# Altium schematic sheet Top.SchDoc: RGBW LED Driver
size A4; DocumentNumber: 1; SheetNumber: 1; SheetTotal: 3
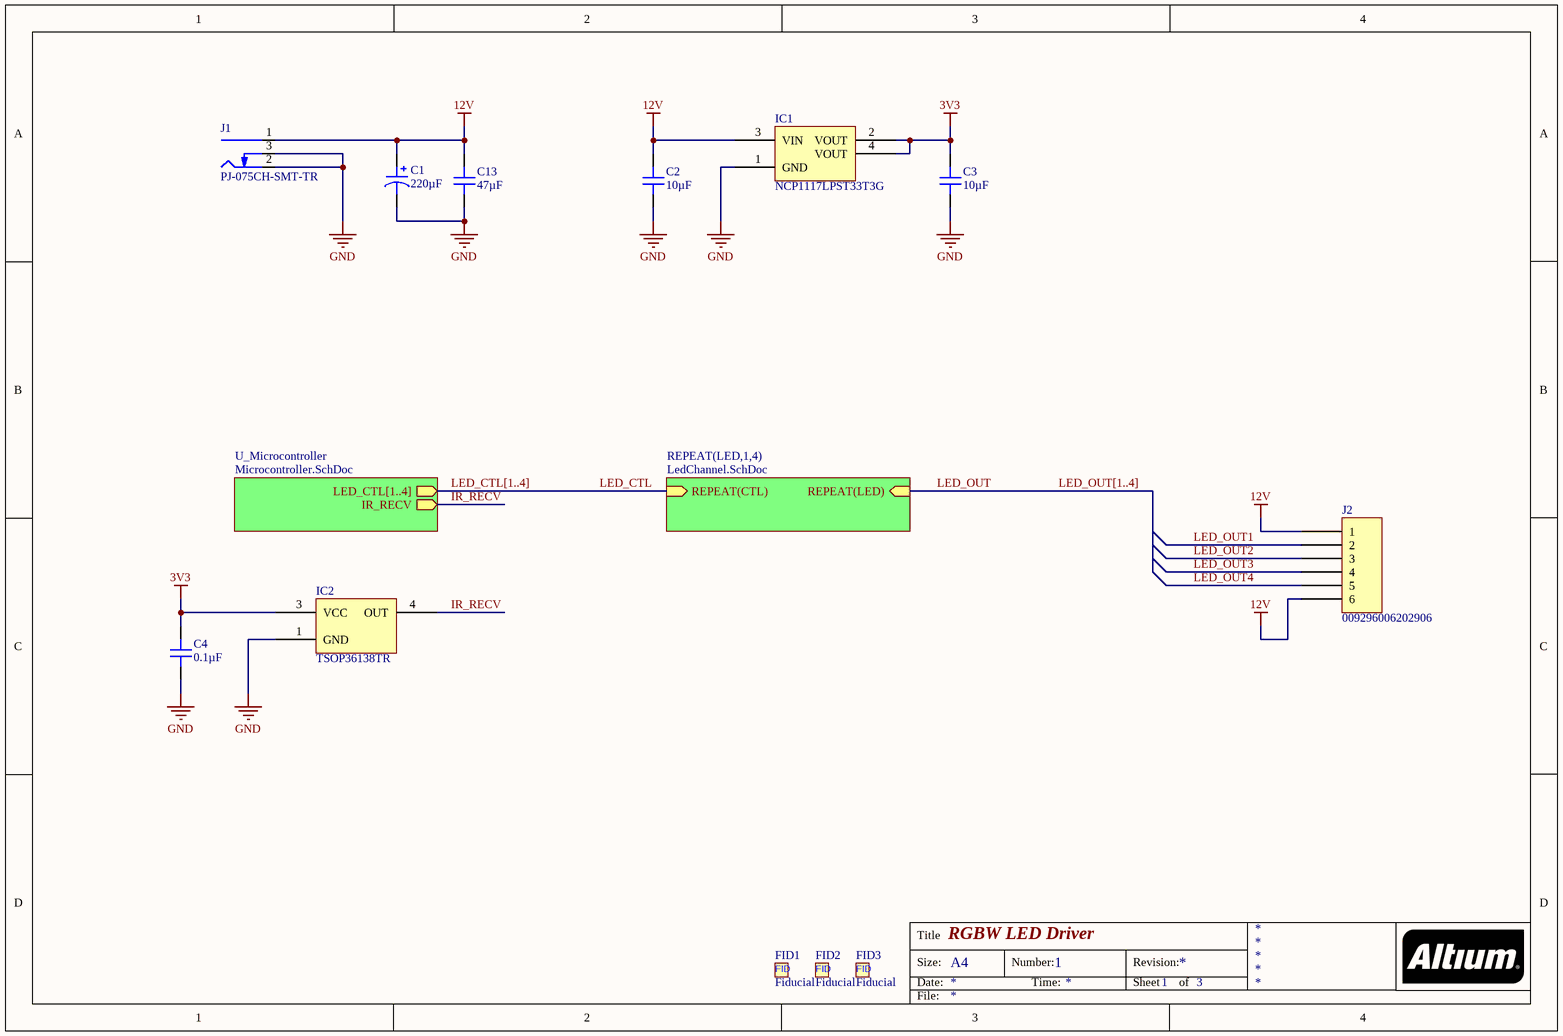
[diagram p0: Top.SchDoc]

## Parts
C1  220µF  [CAP ALSMD 8.3MM H10.5MM]
C2  10µF  [CAP 1206_3216 - 1.8MM]
C3  10µF  [CAP 1206_3216 - 1.8MM]
C4  0.1µF  [CAP 0603_1608]
C13  47µF  [CAP 1206_3216 - 1.8MM]
FID1  Fiducial  [Fiducial-1mm]
FID2  Fiducial  [Fiducial-1mm]
FID3  Fiducial  [Fiducial-1mm]
IC1  NCP1117LPST33T3G  [ON SEMI SOT-223 ST(318H)]
IC2  TSOP36138TR  [VISHAY TSOP36X-TR]
J1  PJ-075CH-SMT-TR  [CUI PJ-075-SMT]
J2  009296006202906  [AVX 9296006202806]

## Sub-sheets
REPEAT(LED,1,4) = LedChannel.SchDoc: REPEAT(CTL) (in), REPEAT(LED) (in)
U_Microcontroller = Microcontroller.SchDoc: LED_CTL[1..4] (out), IR_RECV (out)

## Nets
3V3: C3.2 C4.2 IC1.2(VOUT) IC1.4(VOUT) IC2.3(VCC)
12V: C1.1 C2.2 C13.2 IC1.3(VIN) J1.1(Centre) J2.1 J2.6
GND: C1.2 C2.1 C3.1 C4.1 C13.1 IC1.1(GND) IC2.1(GND) J1.2(Outer) J1.3(SW)
IR_RECV: IC2.4(OUT) ; sheet U_Microcontroller/IR_RECV
LED_CTL: sheet REPEAT(LED,1,4)/REPEAT(CTL)
LED_OUT: sheet REPEAT(LED,1,4)/REPEAT(LED)
LED_OUT1: J2.2
LED_OUT2: J2.3
LED_OUT3: J2.4
LED_OUT4: J2.5

## Buses and harness runs
bus LED_CTL[1..4] = sheet U_Microcontroller/LED_CTL[1..4]
bus LED_OUT[1..4]

## Notes on the sheet
- Title
- Size:
- Date:
- A4
- Number:
- Time:
- Revision:
- Sheet
- of
- File:
- (in symbol Fiducial) FID

## Library data of the parts
C1 = UUX1E221MNL6GS: CAP ALUM 220UF 20% 25V SMD; Manufacturer: Nichicon; Lifetime @ Temp.: 2000 Hrs @ 105°C; Polarization: Polar; Ripple Current @ High Frequency: 367.9mA @ 10kHz; Ripple Current @ Low Frequency: 283mA @ 120Hz; Surface Mount Land Size: 0.327" L x 0.327" W (8.30mm x 8.30mm); Part Number: UUX1E221MNL6GS; Applications: General Purpose; Capacitance: 220µF; ComponentLink1Description: Datasheet; ComponentLink1URL: http://nichicon-us.com/english/products/pdfs/e-uux.pdf; ComponentLink2Description: DigiKey Link; ComponentLink2URL: http://digikey.com/product-detail/en/nichicon/UUX1E221MNL6GS/493-9620-1-ND/3962952; Device Package: Radial, Can - SMD; Height - Seated (Max): 0.413" (10.50mm); LastUpdated: 21/01/2020 04:02:43; Lifecycle Status: Active; Minimum Order: 1; Mounting Type: Surface Mount; Operating Temperature: -55°C ~ 105°C; Package / Case: Radial, Can - SMD; Packaging: TapeAndReel; PartId: 7707; Part Status: Active; Price: 0.16; Series: UUX; Size / Dimension: 0.315" Dia (8.00mm); Supplier 1: DigiKey; Supplier Part Number 1: 493-9620-1-ND; Tolerance: ±20%; Value: 220µF; Voltage - Rated: 25V
C2 C3 = CL31A106KAHNNNE: CAP CER 10UF 25V X5R 1206; Manufacturer: Samsung Electro-Mechanics; Tolerance: ±10%; Part Number: CL31A106KAHNNNE; Value: 10µF; Applications: General Purpose; Capacitance: 10µF; ComponentLink1Description: Datasheet; ComponentLink1URL: http://www.samsungsem.com/kr/support/product-search/mlcc/CL31A106KAHNNNE.jsp; ComponentLink2Description: DigiKey Link; ComponentLink2URL: http://digikey.com/product-detail/en/samsung-electro-mechanics/CL31A106KAHNNNE/1276-1075-1-ND/3889161; Device Package: 1206 (3216 Metric); LastUpdated: 21/01/2020 00:03:42; Lifecycle Status: Active; Minimum Order: 1; Mounting Type: Surface Mount, MLCC; Operating Temperature: -55°C ~ 85°C; Package / Case: 1206 (3216 Metric); Packaging: TapeAndReel; PartId: 21774; Part Status: Active; Price: 0.04; Series: CL; Size / Dimension: 0.126" L x 0.063" W (3.20mm x 1.60mm); Supplier 1: DigiKey; Supplier Part Number 1: 1276-1075-1-ND; Temperature Coefficient: X5R; Thickness (Max): 0.071" (1.80mm); Voltage - Rated: 25V
C4 = CS0603KRX7R7BB104: CAP CER 0.1UF 16V X7R 0603; Manufacturer: Yageo; Tolerance: ±10%; Part Number: CS0603KRX7R7BB104; Value: 0.1µF; Applications: Boardflex Sensitive; Capacitance: 0.1µF; ComponentLink1Description: Datasheet; ComponentLink1URL: http://www.yageo.com/NewPortal/yageodocoutput?fileName=/pdf/MLCC/UPY-ST_NPOX7R_16V-to-3KV_5.pdf; ComponentLink2Description: DigiKey Link; ComponentLink2URL: http://digikey.com/product-detail/en/yageo/CS0603KRX7R7BB104/311-3560-1-ND/7648487; Device Package: 0603 (1608 Metric); Features: Soft Termination; LastUpdated: 02/01/2020 00:02:08; Lifecycle Status: Active; Minimum Order: 1; Mounting Type: Surface Mount, MLCC; Operating Temperature: -55°C ~ 125°C; Package / Case: 0603 (1608 Metric); Packaging: ReReel; PartId: 2286; Part Status: Active; Price: 0.00; Series: CS; Size / Dimension: 0.063" L x 0.031" W (1.60mm x 0.80mm); Supplier 1: DigiKey; Supplier Part Number 1: 311-3560-1-ND; Temperature Coefficient: X7R; Thickness (Max): 0.037" (0.95mm); Voltage - Rated: 16V
C13 = GRM31CR61E476ME44L: CAP CER 47UF 25V X5R 1206; Manufacturer: Murata Electronics; Tolerance: ±20%; Part Number: GRM31CR61E476ME44L; Value: 47µF; Applications: General Purpose; Capacitance: 47µF; ComponentLink2Description: DigiKey Link; ComponentLink2URL: http://digikey.com/product-detail/en/murata-electronics/GRM31CR61E476ME44L/490-16268-1-ND/7363259; Device Package: 1206 (3216 Metric); LastUpdated: 21/01/2020 00:03:34; Lifecycle Status: Active; Minimum Order: 1; Mounting Type: Surface Mount, MLCC; Operating Temperature: -55°C ~ 85°C; Package / Case: 1206 (3216 Metric); Packaging: TapeAndReel; PartId: 22811; Part Status: Active; Price: 0.36; Series: GRM; Size / Dimension: 0.126" L x 0.063" W (3.20mm x 1.60mm); Supplier 1: DigiKey; Supplier Part Number 1: 490-16268-1-ND; Temperature Coefficient: X5R; Thickness (Max): 0.071" (1.80mm); Voltage - Rated: 25V
IC1 = NCP1117LPST33T3G: IC REG LINEAR 3.3V 1A SOT223; Manufacturer: ON Semiconductor; Current - Quiescent (Iq): 700µA; Number of Regulators: 1; Output Configuration: Positive; Output Type: Fixed; Protection Features: Over Current, Over Temperature; PSRR: 60dB (120Hz); Voltage Dropout (Max): 1.4V @ 1A; Voltage - Input (Max): 18V; Part Number: NCP1117LPST33T3G; ComponentLink1Description: Datasheet; ComponentLink1URL: http://www.onsemi.com/pub/Collateral/NCP1117LP-D.PDF; ComponentLink2Description: DigiKey Link; ComponentLink2URL: http://digikey.com/product-detail/en/on-semiconductor/NCP1117LPST33T3G/NCP1117LPST33T3GOSCT-ND/3462387; Current - Output: 1A; Device Package: TO-261-4, TO-261AA; LastUpdated: 21/01/2020 03:56:49; Lifecycle Status: Active; Minimum Order: 1; Mounting Type: Surface Mount; Operating Temperature: 0°C ~ 125°C; Package / Case: TO-261-4, TO-261AA; Packaging: TapeAndReel; Part Status: Active; Price: 0.12; Series: -; Supplier 1: DigiKey; Supplier Part Number 1: NCP1117LPST33T3GOSCT-ND; Supplier Device Package: SOT-223; Voltage - Output (Min/Fixed): 3.3V
IC2 = TSOP36138TR: SENSOR REMOTE REC 38.0KHZ 45M; Manufacturer: Vishay Semiconductor Opto Division; Current - Supply: 350µA; Voltage - Supply: 2.5V ~ 5.5V; Part Number: TSOP36138TR; B.P.F. Center Frequency: 38.0kHz; ComponentLink1Description: Datasheet; ComponentLink1URL: http://www.vishay.com/docs/82567/tsop361.pdf; ComponentLink2Description: DigiKey Link; ComponentLink2URL: http://digikey.com/product-detail/en/vishay-semiconductor-opto-division/TSOP36138TR/TSOP36138TRCT-ND/8556857; LastUpdated: 20/04/2020 13:27:50; Lifecycle Status: Active; Minimum Order: 1; Mounting Type: Surface Mount; Operating Temperature: -25°C ~ 85°C (TA); Orientation: Side or Top View; Packaging: TapeAndReel; Part Status: Active; Price: 0.71; Sensing Distance: 45m; Series: -; Supplier 1: DigiKey; Supplier Part Number 1: TSOP36138TRCT-ND
J1 = PJ-075CH-SMT-TR: CONN PWR JACK 1X3.4MM SOLDER; Manufacturer: CUI Devices; Actual Diameter: 0.039" (1.00mm ID), 0.146" (3.70mm OD); Current Rating (Amps): 3.5A; Gender: Male; Industry Recognized Mating Diameter: 1.00mm ID (0.039"), 3.40mm OD (0.134"); Internal Switch(s): Single Switch, Normally Closed; Material Flammability Rating: UL94 V-0; Mating Length/Depth: 0.252" (6.40mm); Number of Positions/Contacts: 2 Conductors, 3 Contacts; Shielding: Unshielded; Voltage - Rated: 24VDC; Part Number: PJ-075CH-SMT-TR; ComponentLink1Description: Datasheet; ComponentLink1URL: https://www.cuidevices.com/product/resource/digikeypdf/pj-075ch-smt-tr.pdf; ComponentLink2Description: DigiKey Link; ComponentLink2URL: //digikey.com/product-detail/en/cui-devices/PJ-075CH-SMT-TR/CP-075CHPJTR-ND/3661519; Connector Type: Jack; Features: Board Guide; LastUpdated: 16/12/2019 19:00:05; Lifecycle Status: 0; Minimum Order: 1; Mounting Type: Surface Mount, Right Angle; Packaging: TapeAndReel; Part Status: Active; Price: 0.56; Series: -; Supplier 1: DigiKey; Supplier Part Number 1: CP-075CHPJTR-ND; Termination: Solder
J2 = 009296006202906: CONN WIRE POKE-IN 6POS SMD RA; Manufacturer: AVX Corporation; Board-Side Pitch: 0.118" (3.00mm); Connector Type: Individual Wires; Number of Positions: 6; Wire Gauge: 20-26 AWG; Part Number: 009296006202906; Cable Pitch: 0.118" (3.00mm); Cable Termination: Poke-In; Color: White; ComponentLink1Description: Datasheet; ComponentLink1URL: http://datasheets.avx.com/PHLPHorizontal_00-9296.pdf; ComponentLink2Description: DigiKey Link; ComponentLink2URL: http://digikey.com/product-detail/en/avx-corporation/009296006202906/478-9537-1-ND/5161731; Contact Finish: Tin; Features: Closed End; LastUpdated: 01/05/2020 07:33:23; Lifecycle Status: Active; Minimum Order: 1; Mounting Type: Surface Mount, Right Angle; Number of Rows: 1; Packaging: TapeAndReel; Part Status: Active; Price: 0.38; Series: 9296; Supplier 1: DigiKey; Supplier Part Number 1: 478-9537-1-ND